# EasyEDA Pro project ProPrj_小中心板_2025-08-09.epro, board PCB1
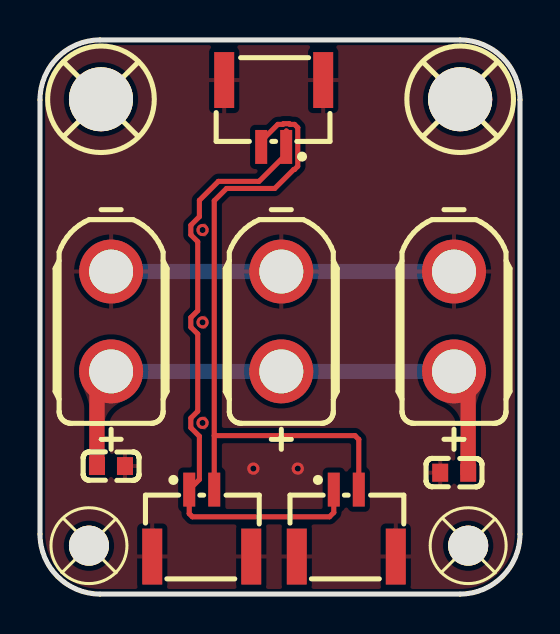
[diagram p10: board, top side]
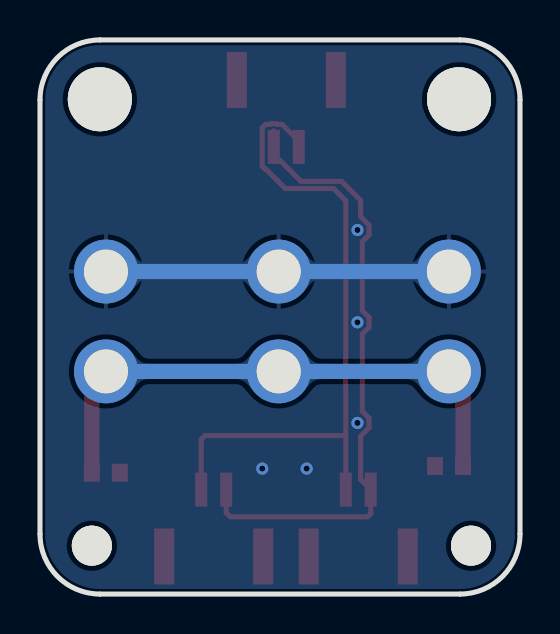
[diagram p11: board, bottom side, seen from below]

Outline 24 x 27.75 mm; copper layers: Top Layer, Bottom Layer. Coordinates in mm from the lower left corner of the outline.
Outline path: 0,24.75 0,3 arc(0.88,0.88) 3,0 21,0 arc(23.12,0.88) 24,3 24,24.75 arc(23.12,26.87) 21,27.75 3,27.75 arc(0.88,26.87) 0,24.75
Stack: Top Layer 0.035mm / Dielectric1 1.51mm FR4 er 4.5 / Bottom Layer 0.035mm

## Design rules (mm)
template: JLCPCB Capability(Two Layers Board)
spacing copperThickness1oz (default): track to track 0.102, other pairs 0.152 to 0.3
spacing copperThickness2oz: track to track 0.203, other pairs 0.152 to 0.3
track width copperThickness1oz (default): min 0.127, default 0.254, max 2.54
track width copperThickness2oz: min 0.203, default 0.254, max 2.54
differential pair differentialPair (default): width min 0.127, default 0.254, max 2.54; gap min 0.152, default 0.152
via viaSize (default): diameter min 0.5, default 0.61, max 10; hole min 0.3, default 0.305, max 6.3

## Placement (name value [footprint] x y rotation side)
C1  22uf  [C0603]  20.71 6.08 0 top
C4  22uF  [C0603]  3.55 6.41 180 top
CN15  WAFER-GH1.25-2PLB  [CONN-TH_2P-P1.25_XUNPU_WAFER-GH1.25-2PLB]  15.31 3.55 0 top
CN16  WAFER-GH1.25-2PLB  [CONN-TH_2P-P1.25_XUNPU_WAFER-GH1.25-2PLB]  8.09 3.55 0 top
CN17  WAFER-GH1.25-2PLB  [CONN-TH_2P-P1.25_XUNPU_WAFER-GH1.25-2PLB]  11.68 24.06 180 top
J1  XT30UPB-F30.G.Y  [CONN-TH_XT30UPB-F]  20.7 13.65 90 top
J2  XT30UPB-F30.G.Y  [CONN-TH_XT30UPB-F]  3.56 13.65 90 top
J3  XT30UPB-F30.G.Y  [CONN-TH_XT30UPB-F]  12.06 13.65 90 top
SCREW1  -  [M2螺丝]  2.45 2.42 0 top
SCREW2  -  [M2螺丝]  21.41 2.42 0 top
SCREW3  -  [M3螺丝]  3.05 24.78 0 top
SCREW4  -  [M3螺丝]  21.01 24.78 0 top

## Footprints (pads in the part's own frame, mm; a bottom-side part is the same pattern mirrored in y, then rotated)
C0603
  rect 0.8x0.9 smd: 1(-0.7,0) 2(0.7,0)
CONN-TH_2P-P1.25_XUNPU_WAFER-GH1.25-2PLB
  rect 0.6x1.7 smd: 1(-0.625,1.675) 2(0.625,1.675)
  rect 1x2.8 smd: 3(2.475,-1.675) 4(-2.475,-1.675)
CONN-TH_XT30UPB-F
  round 3.2 hole 2.2: 1(-2.5,0) 2(2.5,0)
M2螺丝
  round 2 hole 2: 1(0,0)
M3螺丝
  round 3.2 hole 3.2: 1(0,0)

## Nets
As in the schematic.

Pads without a net: SCREW1 1; SCREW2 1; SCREW3 1; SCREW4 1

## Via types
v1: diameter 0.61, hole 0.305, Top Layer to Bottom Layer, 5 vias

## Routing (per net, layer and track width the routed paths; a pad name or vN(x,y) marks a point on that pad's centre or on a via; arc(x,y) is an arc through that point)
GND: length 17.1
  Bottom Layer w0.762: J1.2 J3.2 J2.2
  vias: v1(8.13,18.23) v1(8.13,13.6) v1(8.13,8.57) v1(10.67,6.28) v1(12.89,6.28)
VCC_BAT: length 27.5
  Top Layer w0.762: J2.1 2.85,10.44 C4.2 ; J1.1 21.41,10.44 C1.2
  Bottom Layer w0.762: J2.1 J3.1 J1.1
CAN_H: length 33.7
  Top Layer w0.254: 8.71,7.93 15.75,7.93 15.94,7.74 CN15.2 ; 8.71,7.93 8.71,19.69 9.33,20.31 11.73,20.31 12.69,21.26 12.72,21.26 12.89,21.42 12.89,23.35 12.72,23.52 12.5,23.52 12.47,23.55 12.17,23.55 12.14,23.52 11.89,23.52 11.04,22.66 11.04,22.41 CN17.2 ; 8.71,7.93 CN16.2
CAN_L: length 31.8
  Top Layer w0.254: 12.32,23.2 12.32,22.03 10.95,20.66 8.92,20.66 7.97,19.71 7.97,18.9 7.54,18.47 7.54,17.99 7.89,17.64 7.89,14.19 7.54,13.85 7.54,13.36 7.89,13.02 7.89,9.15 7.54,8.81 7.54,8.33 7.97,7.9 7.97,5.74 CN16.1 7.46,4.03 7.62,3.87 14.48,3.87 14.69,4.08 CN15.1

## Copper pours and planes (outline as drawn; the poured copper is in the pictures)
GND on Top Layer: -1.91,28.89 26.54,28.89 26.54,-1.84 -1.91,-1.84
GND on Bottom Layer: -2.03,29.02 26.29,29.02 26.29,-1.59 -2.03,-1.59

Small or netless copper shapes (teardrops, artwork), in the pictures only: 4 on Top Layer, 8 on Bottom Layer
